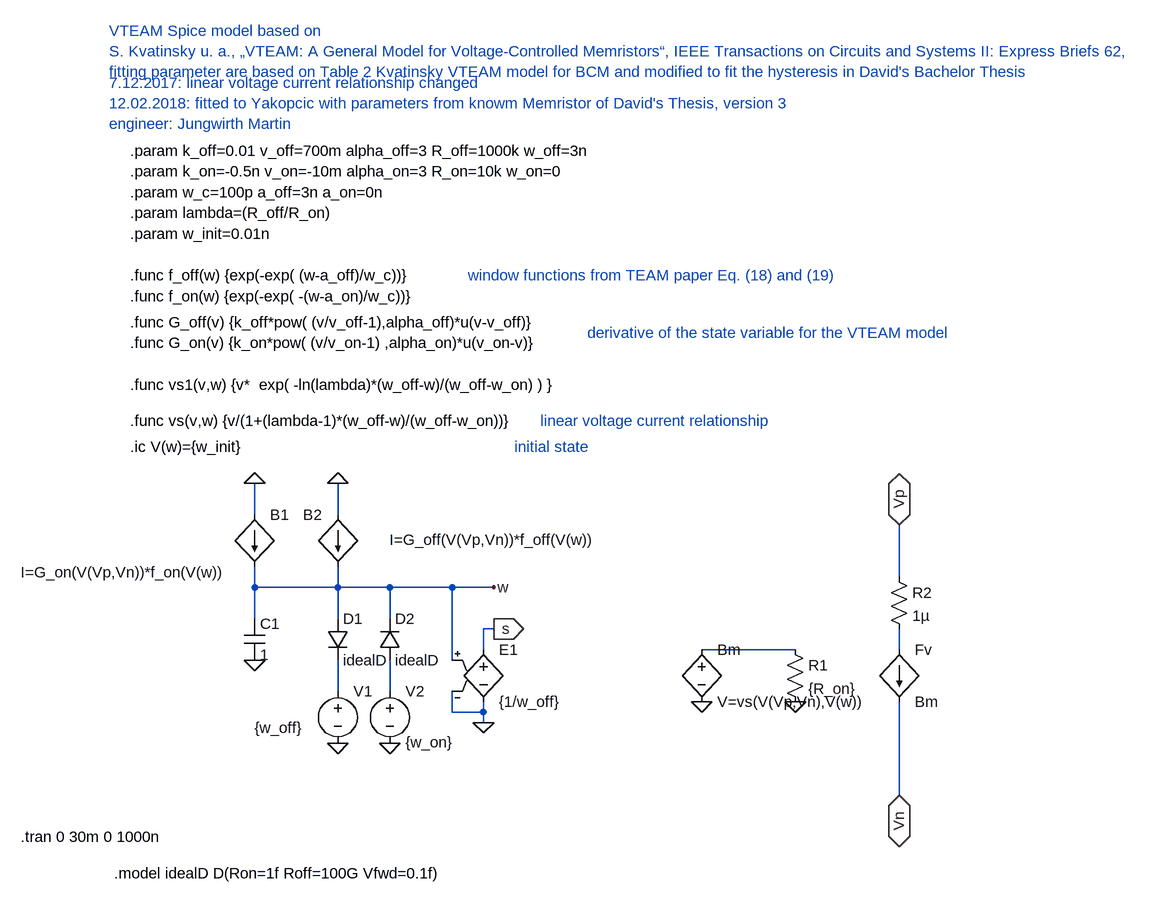
[diagram p0: schematic VTEAM_knowm.asc]
VTEAM_knowm.asc, the LTspice schematic file:
Version 4
SHEET 1 2456 1664
WIRE 208 576 208 528
WIRE 336 576 336 528
WIRE 1200 672 1200 592
WIRE 208 688 208 656
WIRE 336 688 336 656
WIRE 336 688 208 688
WIRE 416 688 336 688
WIRE 512 688 416 688
WIRE 576 688 512 688
WIRE 208 736 208 688
WIRE 336 736 336 688
WIRE 416 736 416 688
WIRE 576 752 560 752
WIRE 560 784 560 752
WIRE 1040 784 896 784
WIRE 1200 784 1200 752
WIRE 512 800 512 688
WIRE 336 848 336 800
WIRE 416 848 416 800
WIRE 512 880 512 848
WIRE 560 880 560 864
WIRE 560 880 512 880
WIRE 560 896 560 880
WIRE 1200 1008 1200 864
FLAG 208 528 0
FLAG 336 528 0
FLAG 208 800 0
FLAG 336 928 0
FLAG 416 928 0
FLAG 576 688 w
FLAG 896 864 0
FLAG 1040 864 0
FLAG 1200 592 Vp
IOPIN 1200 592 BiDir
FLAG 1200 1008 Vn
IOPIN 1200 1008 BiDir
FLAG 560 896 0
FLAG 576 752 s
IOPIN 576 752 Out
SYMBOL bi 208 576 R0
WINDOW 3 -360 89 Left 2
SYMATTR Value I=G_on(V(Vp,Vn))*f_on(V(w))
SYMATTR InstName B1
SYMBOL bi 336 576 M0
WINDOW 3 -396 39 Left 2
SYMATTR Value I=G_off(V(Vp,Vn))*f_off(V(w))
SYMATTR InstName B2
SYMBOL cap 192 736 R0
SYMATTR InstName C1
SYMATTR Value 1
SYMBOL diode 320 736 R0
SYMATTR InstName D1
SYMATTR Value idealD
SYMBOL diode 400 800 M180
WINDOW 0 24 64 Left 2
WINDOW 3 24 0 Left 2
SYMATTR InstName D2
SYMATTR Value idealD
SYMBOL voltage 336 832 R0
WINDOW 123 0 0 Left 2
WINDOW 39 0 0 Left 2
WINDOW 3 -128 72 Left 2
SYMATTR Value {w_off}
SYMATTR InstName V1
SYMBOL voltage 416 832 R0
WINDOW 3 24 94 Left 2
WINDOW 123 0 0 Left 2
WINDOW 39 0 0 Left 2
SYMATTR Value {w_on}
SYMATTR InstName V2
SYMBOL res 1024 768 R0
SYMATTR InstName R1
SYMATTR Value {R_on}
SYMBOL f 1200 784 R0
SYMATTR InstName Fv
SYMATTR Value Bm
SYMATTR Value2 -1
SYMBOL bv 896 768 R0
SYMATTR InstName Bm
SYMATTR Value V=vs(V(Vp,Vn),V(w))
SYMBOL e 560 768 R0
SYMATTR InstName E1
SYMATTR Value {1/w_off}
SYMBOL res 1184 656 R0
SYMATTR InstName R2
SYMATTR Value 1µ
TEXT 16 16 Left 2 !.param k_off=0.01 v_off=700m alpha_off=3 R_off=1000k w_off=3n
TEXT 16 48 Left 2 !.param k_on=-0.5n v_on=-10m alpha_on=3 R_on=10k w_on=0
TEXT 16 80 Left 2 !.param w_c=100p a_off=3n a_on=0n
TEXT 16 208 Left 2 !.func f_off(w) {exp(-exp( (w-a_off)/w_c))}
TEXT 16 240 Left 2 !.func f_on(w) {exp(-exp( -(w-a_on)/w_c))}
TEXT 16 280 Left 2 !.func G_off(v) {k_off*pow( (v/v_off-1),alpha_off)*u(v-v_off)}
TEXT 16 312 Left 2 !.func G_on(v) {k_on*pow( (v/v_on-1) ,alpha_on)*u(v_on-v)}
TEXT 16 432 Left 2 !.func vs(v,w) {v/(1+(lambda-1)*(w_off-w)/(w_off-w_on))}
TEXT -16 -168 Left 2 ;VTEAM Spice model based on \nS. Kvatinsky u. a., „VTEAM: A General Model for Voltage-Controlled Memristors“, IEEE Transactions on Circuits and Systems II: Express Briefs 62,\nfitting parameter are based on Table 2 Kvatinsky VTEAM model for BCM and modified to fit the hysteresis in David's Bachelor Thesis
TEXT 16 112 Left 2 !.param lambda=(R_off/R_on)
TEXT 16 472 Left 2 !.ic V(w)={w_init}
TEXT 536 208 Left 2 ;window functions from TEAM paper Eq. (18) and (19)
TEXT 720 296 Left 2 ;derivative of the state variable for the VTEAM model
TEXT 648 432 Left 2 ;linear voltage current relationship
TEXT 608 472 Left 2 ;initial state
TEXT -8 1128 Left 2 !.model idealD D(Ron=1f Roff=100G Vfwd=0.1f)
TEXT 16 144 Left 2 !.param w_init=0.01n
TEXT -16 -88 Left 2 ;7.12.2017: linear voltage current relationship changed\n12.02.2018: fitted to Yakopcic with parameters from knowm Memristor of David's Thesis, version 3\nengineer: Jungwirth Martin
TEXT -152 1072 Left 2 !.tran 0 30m 0 1000n
TEXT 16 376 Left 2 !.func vs1(v,w) {v*  exp( -ln(lambda)*(w_off-w)/(w_off-w_on) ) }

The netlist it stands for:
* VTEAM_knowm.asc
B1 0 w I=G_on(V(Vp,Vn))*f_on(V(w))
B2 0 w I=G_off(V(Vp,Vn))*f_off(V(w))
C1 w 0 1
D1 w N003 idealD
D2 N004 w idealD
V1 N003 0 {w_off}
V2 N004 0 {w_on}
R1 N001 0 {R_on}
Fv N002 Vn Bm -1
Bm N001 0 V=vs(V(Vp,Vn),V(w))
E1 s 0 w 0 {1/w_off}
R2 Vp N002 1µ
.model D D
.lib standard.dio
.param k_off=0.01 v_off=700m alpha_off=3 R_off=1000k w_off=3n
.param k_on=-0.5n v_on=-10m alpha_on=3 R_on=10k w_on=0
.param w_c=100p a_off=3n a_on=0n
.func f_off(w) {exp(-exp( (w-a_off)/w_c))}
.func f_on(w) {exp(-exp( -(w-a_on)/w_c))}
.func G_off(v) {k_off*pow( (v/v_off-1),alpha_off)*u(v-v_off)}
.func G_on(v) {k_on*pow( (v/v_on-1) ,alpha_on)*u(v_on-v)}
.func vs(v,w) {v/(1+(lambda-1)*(w_off-w)/(w_off-w_on))}
* VTEAM Spice model based on
* S. Kvatinsky u. a., „VTEAM: A General Model for Voltage-Controlled Memristors“, IEEE Transactions on Circuits and Systems II: Express Briefs 62,
* fitting parameter are based on Table 2 Kvatinsky VTEAM model for BCM and modified to fit the hysteresis in David's Bachelor Thesis
.param lambda=(R_off/R_on)
.ic V(w)={w_init}
* window functions from TEAM paper Eq. (18) and (19)
* derivative of the state variable for the VTEAM model
* linear voltage current relationship
* initial state
.model idealD D(Ron=1f Roff=100G Vfwd=0.1f)
.param w_init=0.01n
* 7.12.2017: linear voltage current relationship changed
* 12.02.2018: fitted to Yakopcic with parameters from knowm Memristor of David's Thesis, version 3
* engineer: Jungwirth Martin
.tran 0 30m 0 1000n
.func vs1(v,w) {v*  exp( -ln(lambda)*(w_off-w)/(w_off-w_on) ) }
.backanno
.end